# EAGLE design easyMySens-Std-V2-021 (EAGLE 7.6.0)
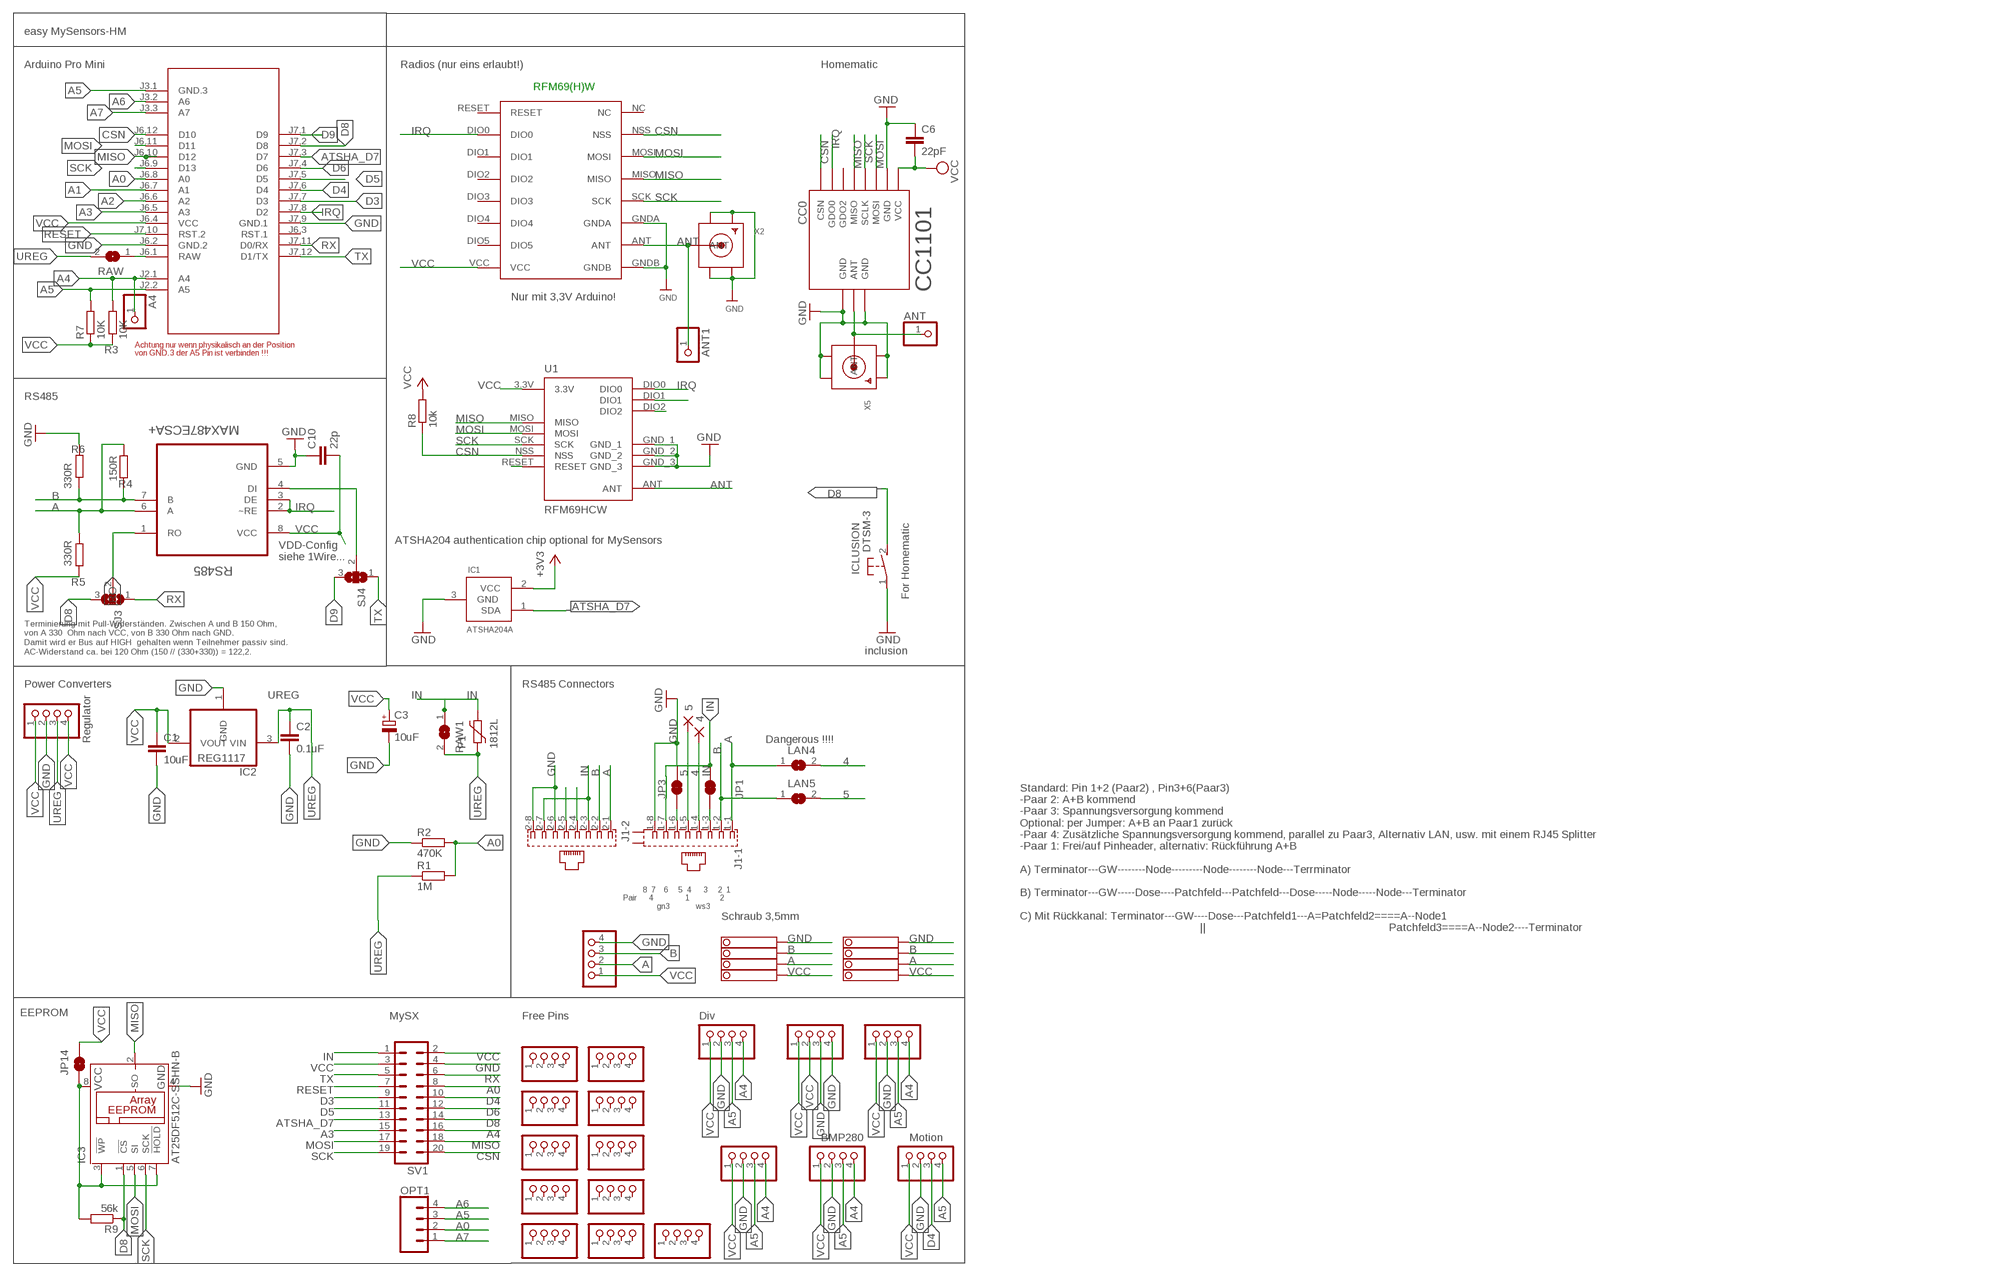
[diagram p0: schematic, sheet 1]

## Parts
4  1,6/0,8  [1,6/0,8]
5  1,6/0,8  [1,6/0,8]
A4  PINHD-1X1  [1X01]
ANT  PINHD-1X1  [1X01]
ANT1  PINHD-1X1  [1X01]
BH1750  PINHD-1X04_2.54-S  [1X04-S]
C1  10uF  C-EUC1210  [C1210]
C2  0.1uF  C-EUC1206  [C1206]
C3  10uF  CPOL-EUSMCC  [SMC_C]
C6  22pF  C-EUC0805  [C0805]
C10  22p  C-EUC0805  [C0805]
CC0  CC1101  CC1101_MODULE1SMD  [CC1101_MODULE1_SMD]
F1  1812L  [1812L]
I2C-1  PINHD-1X04_2.54-S  [1X04-S]
I2C-2  PINHD-1X04_2.54-S  [1X04-S]
I2C-3  PINHD-1X04_2.54-S  [1X04-S]
I2C-4  PINHD-1X04_2.54-S  [1X04-S]
IC1  ATSHA204A  [SOT23]
IC2  REG1117  [SOT223]
IC3  AT25DF512C-SSHN-B  25AA080SN  [SO-08]
ICLUSION  DTSM-3  [DTSM-3]
J1  557570-1  [557570-1]
JP1  JUMPER-SMT_2_NC_TRACE_SILK  [SMT-JUMPER_2_NC_TRACE_SILK]
JP2  PINHD-1X04_2.54-S  [1X04-S]
JP3  JUMPER-SMT_2_NC_TRACE_SILK  [SMT-JUMPER_2_NC_TRACE_SILK]
JP4  PINHD-1X04_2.54-S  [1X04-S]
JP5  PINHD-1X04_2.54-S  [1X04-S]
JP6  PINHD-1X04_2.54-S  [1X04-S]
JP7  PINHD-1X04_2.54-S  [1X04-S]
JP8  PINHD-1X04_2.54-S  [1X04-S]
JP9  PINHD-1X04_2.54-S  [1X04-S]
JP10  PINHD-1X04_2.54-S  [1X04-S]
JP11  PINHD-1X04_2.54-S  [1X04-S]
JP12  PINHD-1X04_2.54-S  [1X04-S]
JP13  PINHD-1X04_2.54-S  [1X04-S]
JP14  JUMPER-SMT_2_NC_TRACE_SILK  [SMT-JUMPER_2_NC_TRACE_SILK]
LAN4  SJ  [SJ]
LAN5  SJ  [SJ]
M1  ARDUINO-PRO-MINI-3.3V#NP  [ARDUINO-PRO-MINI#NP]
MOTION  PINHD-1X04_2.54-S  [1X04-S]
OPT1  CONN_04  [1X04]
R1  1M  R-EU_R0805  [R0805]
R2  470K  R-EU_R0805  [R0805]
R3  10K  R-EU_R0805  [R0805]
R4  150R  R-EU_R0805  [R0805]
R5  330R  R-EU_R0805  [R0805]
R6  330R  R-EU_R0805  [R0805]
R7  10K  R-EU_R0805  [R0805]
R8  10k  R-EU_M0805  [M0805]
R9  56k  R-EU_M0805  [M0805]
RAW  SJ  [SJ]
RAW1  SJ  [SJ]
RFM69W  RFM69HW  [RFM]
RS485  MAX487ECSA+  [SOIC127P600X175-8N]
RS485-  PINHD-1X04_2.54-S  [1X04-S]
SJ3  SJ2W  [SJ_2]
SJ4  SJ2W  [SJ_2]
STEPDWN  PINHD-1X04_2.54-S  [1X04-S]
SV1  MA10-2  [MA10-2]
U1  RFM69HCW  [RFM69HCW-XXXS2]
X1  1751264  [1751264]
X2  SMACONNECTOR_EDGE  [SMA_EDGELAUNCH]
X4  1751264  [1751264]
X5  SMACONNECTOR_EDGE  [SMA_EDGELAUNCH]

## Nets
3: J1.1-3 JP1.1
3.3V [Power]: IC1.2(VCC) ; supply symbol labelled +3V3
4: 4.1(P) J1.1-4 LAN4.2
5: 5.1(P) J1.1-5 LAN5.2
6: J1.1-6 JP3.1
A: J1.1-1 J1.2-1 LAN4.1 R4.1 R5.2 RS485-.2 RS485.6(A) X1.2 X4.2
A0: M1.J6.8(A0) OPT1.2 R1.2 R2.2 SV1.8
A1: M1.J6.7(A1)
A2: M1.J6.6(A2)
A3: M1.J6.5(A3) SV1.15
A4: A4.1 BH1750.4 I2C-1.4 I2C-2.4 I2C-4.4 M1.J2.1(A4) R3.2 SV1.16
A5: BH1750.3 I2C-1.3 I2C-2.3 I2C-4.3 M1.J2.2(A5) M1.J3.1(GND.3) MOTION.4 OPT1.3 R7.2
A6: M1.J3.2(A6) OPT1.4
A7: M1.J3.3(A7) OPT1.1
ANT: ANT1.1 RFM69W.ANT U1.ANT X2.P(ANT)
ANT0: ANT.1 CC0.ANT X5.P(ANT)
ATSHA_D7: IC1.1(SDA) M1.J7.3(D7) SV1.13
B: J1.1-2 J1.2-2 LAN5.1 R4.2 R6.1 RS485-.3 RS485.7(B) X1.3 X4.3
CSN: CC0.CSN M1.J6.12(D10) R8.1 RFM69W.NSS SV1.20 U1.NSS
D3: M1.J7.7(D3) SV1.9
D4: M1.J7.6(D4) MOTION.3 SV1.10
D5: M1.J7.5(D5) SV1.11
D6: M1.J7.4(D6) SV1.12
D8: IC3.1(!CS) ICLUSION.2 M1.J7.2(D8) R9.1 SJ3.3 SV1.14
D9: M1.J7.1(D9) SJ4.3
DI1: RS485.4(DI) SJ4.2
GND [Power]: BH1750.2 C1.2 C2.2 C3.- C6.1 C10.1 CC0.GND@0(GND) CC0.GND@1(GND) CC0.GND@2(GND) I2C-1.2 I2C-2.2 I2C-3.3 I2C-3.4 I2C-4.2 IC1.3(GND) IC2.1(GND) IC3.4(GND) ICLUSION.1 J1.1-8 J1.2-6 J1.2-8 JP3.2 M1.J6.2(GND.2) M1.J7.9(GND.1) MOTION.2 R2.1 R6.2 RFM69W.GNDA RFM69W.GNDB RS485-.4 RS485.5(GND) STEPDWN.2 SV1.4 U1.GND_1 U1.GND_2 U1.GND_3 X1.4 X2.GND@1(GND4) X2.GND@2(GND3) X2.GND@3(GND2) X2.GND@4(GND1) X4.4 X5.GND@1(GND4) X5.GND@2(GND3) X5.GND@3(GND2) X5.GND@4(GND1)
IN [Power]: F1.P$2 J1.1-7 J1.2-3 J1.2-7 JP1.2 RAW1.1 SV1.1
IRQ: CC0.GDO0 M1.J7.8(D2) RFM69W.DIO0 RS485.2(~RE) RS485.3(DE) U1.DIO0
MISO: CC0.MISO IC3.2(SO) M1.J6.10(D12) RFM69W.MISO SV1.18 U1.MISO
MOSI: CC0.MOSI IC3.5(SI) M1.J6.11(D11) RFM69W.MOSI SV1.17 U1.MOSI
N$1: U1.RESET
N$2: J1.2-4
N$5: J1.2-5
N$14: U1.DIO2
N$15: U1.DIO1
RAW [Power]: M1.J6.1(RAW) RAW.1
RESET: M1.J7.10(RST.2) SV1.7
RO: RS485.1(RO) SJ3.2
RX: M1.J7.11(D0/RX) SJ3.1 SV1.6
SCK: CC0.SCLK IC3.6(SCK) M1.J6.9(D13) RFM69W.SCK SV1.19 U1.SCK
TX: M1.J7.12(D1/TX) SJ4.1 SV1.5
UREG [Power]: C2.1 F1.P$1 IC2.3(VIN) R1.1 RAW1.2 RAW.2 STEPDWN.3
VCC [Power]: BH1750.1 C1.1 C3.+ C6.2 C10.2 CC0.VCC I2C-1.1 I2C-2.1 I2C-3.1 I2C-3.2 I2C-4.1 IC2.2(VOUT) JP14.2 M1.J6.4(VCC) MOTION.1 R3.1 R5.1 R7.1 R8.2 RFM69W.VCC RS485-.1 RS485.8(VCC) STEPDWN.1 STEPDWN.4 SV1.2 SV1.3 U1.3.3V X1.1 X4.1
VCC1 [Power]: IC3.3(!WP) IC3.7(!HOLD) IC3.8(VCC) JP14.1 R9.2
Unconnected: CC0.GDO2 J1.G1(-1:S2) J1.G3(-1:S1) JP2.1 JP2.2 JP2.3 JP2.4 JP4.1 JP4.2 JP4.3 JP4.4 JP5.1 JP5.2 JP5.3 JP5.4 JP6.1 JP6.2 JP6.3 JP6.4 JP7.1 JP7.2 JP7.3 JP7.4 JP8.1 JP8.2 JP8.3 JP8.4 JP9.1 JP9.2 JP9.3 JP9.4 JP10.1 JP10.2 JP10.3 JP10.4 JP11.1 JP11.2 JP11.3 JP11.4 JP12.1 JP12.2 JP12.3 JP12.4 JP13.1 JP13.2 JP13.3 JP13.4 M1.J6.3(RST.1) RFM69W.DIO1 RFM69W.DIO2 RFM69W.DIO3 RFM69W.DIO4 RFM69W.DIO5 RFM69W.NC RFM69W.RESET

## Notes on the sheet
- easy MySensors-HM
- Arduino Pro Mini | Radios (nur eins erlaubt!) | Homematic
- RFM69(H)W
- CC1101
- Nur mit 3,3V Arduino!
- Achtung nur wenn physikalisch an der Position 
  von GND.3 der A5 Pin ist verbinden !!!
- RS485
- ATSHA204 authentication chip optional for MySensors
- VDD-Config
  siehe 1Wire...
- For Homematic
- Terminierung mit Pull-Widerständen. Zwischen A und B 150 Ohm,
  von A 330  Ohm nach VCC, von B 330 Ohm nach GND. 
  Damit wird er Bus auf HIGH  gehalten wenn Teilnehmer passiv sind.
  AC-Widerstand ca. bei 120 Ohm (150 // (330+330)) = 122,2.
- inclusion
- Power Converters | RS485 Connectors
- Regulator | Dangerous !!!!
- 8  7    6     5  4      3     2  1
  Pair      4                1               2
                   gn3             ws3
- Schraub 3,5mm
- Standard: Pin 1+2 (Paar2) , Pin3+6(Paar3) 
  -Paar 2: A+B kommend 
  -Paar 3: Spannungsversorgung kommend
  Optional: per Jumper: A+B an Paar1 zurück
  -Paar 4: Zusätzliche Spannungsversorgung kommend, parallel zu Paar3, Alternativ LAN, usw. mit einem RJ45 Splitter 
  -Paar 1: Frei/auf Pinheader, alternativ: Rückführung A+B
  
  A) Terminator---GW--------Node---------Node--------Node---Terrminator
  
  B) Terminator---GW-----Dose----Patchfeld---Patchfeld---Dose-----Node-----Node---Terminator 
  
  C) Mit Rückkanal: Terminator---GW----Dose---Patchfeld1---A=Patchfeld2====A--Node1
                                                              ||                                                             Patchfeld3====A--Node2----Terminator
- EEPROM
- MySX | Free Pins | Div
- BMP280 | Motion

## Library data of the parts
4 5 = wirepad:1,6/0,8: THROUGH-HOLE PAD
A4 ANT ANT1 = pinhead:PINHD-1X1: PIN HEADER
BH1750 I2C-1-I2C-4 JP2 JP4-JP13 MOTION RS485- STEPDWN = pinhead-2:PINHD-1X04: PIN HEADER
C1 C2 C6 C10 = rcl:C-EU: CAPACITOR, European symbol
C3 = rcl:CPOL-EU: POLARIZED CAPACITOR, European symbol
CC0 = wireless:CC1101_MODULE1: CC1101 wireless module for 433/868 MHz (sold from Aliexpress). DIL version for mounting with pin header (and SMD soldering) and SMD only variant available.
F1 = ptc-littlefuse:1812L
IC1 = Sensor:ATSHA204A
IC2 = burr-brown:REG1117: 800mA and 1A Low Dropout (LDO) Positive Regulator 1.8V, 2.5V, 2.85V, 3.3V, 5V, and Adj; MPN: REG1117; OC_FARNELL: 1097566; OC_NEWARK: 14P6981
IC3 = microchip:25*: Serial EEPROM 4K/ 8K , SPI bus; MF: MICROCHIP; MPN: 25AA080/SN; OC_FARNELL: 1816072; OC_NEWARK: 92C7351
ICLUSION = mechanics:DTSM-3: Diptronics SMD button 6x3.5 mm
J1 = con-amp:557570-1: AMP connector
JP1 JP3 JP14 = SparkFun-Jumpers:JUMPER-SMT_2_NC_TRACE: Normally closed trace jumper This jumper has a trace between two pads so it's normally closed (NC). Use a razor knife to open the connection. For best results follow the IPC guidelines for cutting traces: Cutout at least 0.063 mm (0.005 in). Remove all loose material to clean up the cut area. Seal the cut with an approved epoxy. Reapply solder to reclose the connection.
LAN4 LAN5 RAW RAW1 = jumper:SJ: SMD solder JUMPER
M1 = diy-modules:ARDUINO-PRO-MINI-*#NP: Arduino Pro Mini without programming pads
OPT1 = SparkFun-Connectors:CONN_04: Multi connection point. Often used as Generic Header-pin footprint for 0.1 inch spaced/style header connections On any of the 0.1 inch spaced packages, you can populate with these: Break Away Headers - Straight <https://www.sparkfun.com/products/116> (PRT-00116) Break Away Male Headers - Right Angle <https://www.sparkfun.com/products/553> (PRT-00553) Female Headers <https://www.sparkfun.com/products/115> (PRT-00115) Break Away Headers - Machine Pin <https://www.sparkfun.com/products/117> (PRT-00117) Break Away Female Headers - Swiss Machine Pin <https://www.sparkfun.com/products/743> (PRT-00743) For SCREWTERMINALS and SPRING TERMINALS visit here: Screw Terimnals on SparkFun.com <https://www.sparkfun.com/search/results?term=Screw+Terminals> (5mm/3.5mm/2.54mm spacing) This device is also useful as a general connection point to wire up your design to another part of your project. Our various solder wires solder well into these plated through hole pads. Hook-Up Wire - Assortment (Stranded, 22 AWG) <https://www.sparkfun.com/products/11375> (PRT-11375) Hook-Up Wire - Assortment (Solid Core, 22 AWG) <https://www.sparkfun.com/products/11367> (PRT-11367) View the entire wire category on our website here <https://www.sparkfun.com/categories/141> Special notes: Molex polarized connector foot print use with SKU : PRT-08231 with associated crimp pins and housings. 1MM SMD Version SKU: PRT-10208; PROD_ID: CONN-09696
R1-R8 = rcl:R-EU_: RESISTOR, European symbol
R9 = resistor:R-EU_: RESISTOR, European symbol
RFM69W = hoperf:RFM69HW
RS485 = Maxim_By_element14_Batch_1:MAX487ECSA+: Low-Power, Slew-Rate-Limited RS-485/RS-422 Transceivers; MPN: MAX487ECSA+; OC_FARNELL: 9724532; OC_NEWARK: 68K4803; PACKAGE: SOIC-8; SUPPLIER: Maxim
SJ3 SJ4 = jumper:SJ2W: SMD solder JUMPER
SV1 = con-lstb:MA10-2: PIN HEADER; OC_FARNELL: unknown; OC_NEWARK: unknown
U1 = doug:RFM69H
X1 X4 = con-phoenix-350:1751264: MKDS 1/ 4-3,5 Printklemme Nennstrom: 10 A Bemessungsspannung: 160 V Raster: 3,5 mm Polzahl: 4 Montageart: Löten Anschlussart: Schraubanschluss Anschlussrichtung vom Leiter zur Platine: 0° Source: http://eshop.phoenixcontact.com .. 1751264.pdf; MPN: 1751264; OC_FARNELL: unknown; OC_NEWARK: 10R0934
X2 X5 = adafruit:SMACONNECTOR: SMA Connector 90° DIP SMA Connector, 50 Ohm (4UConnector: 07259)

## Net classes
0 default: width 0.305 mm
1 Power: width 0.508 mm

## Board
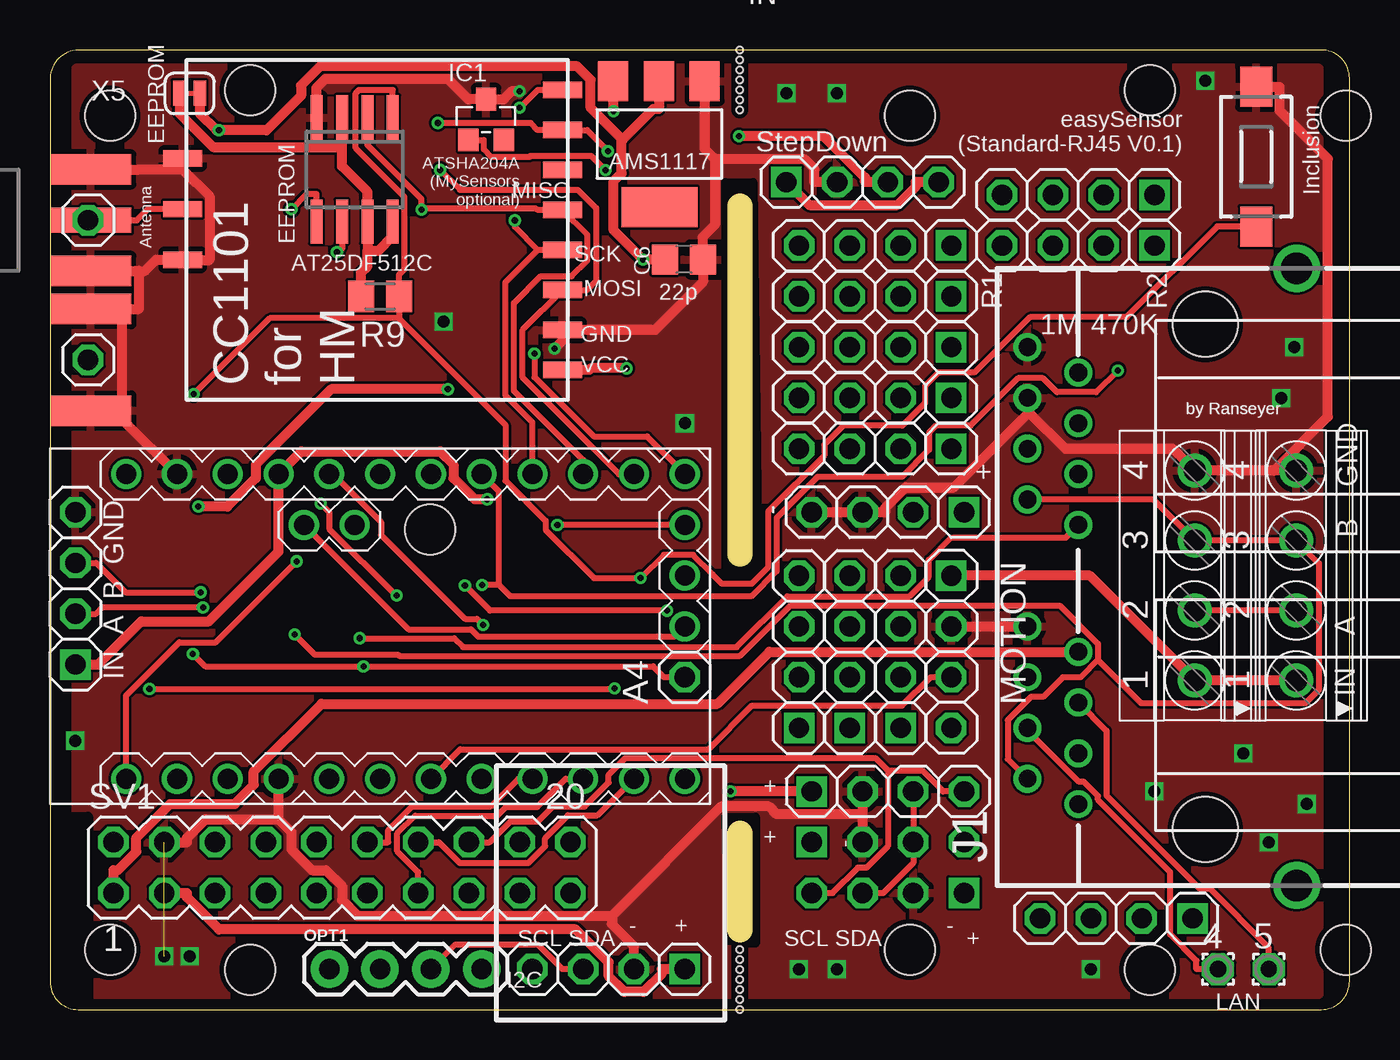
[diagram p1: board, top side]
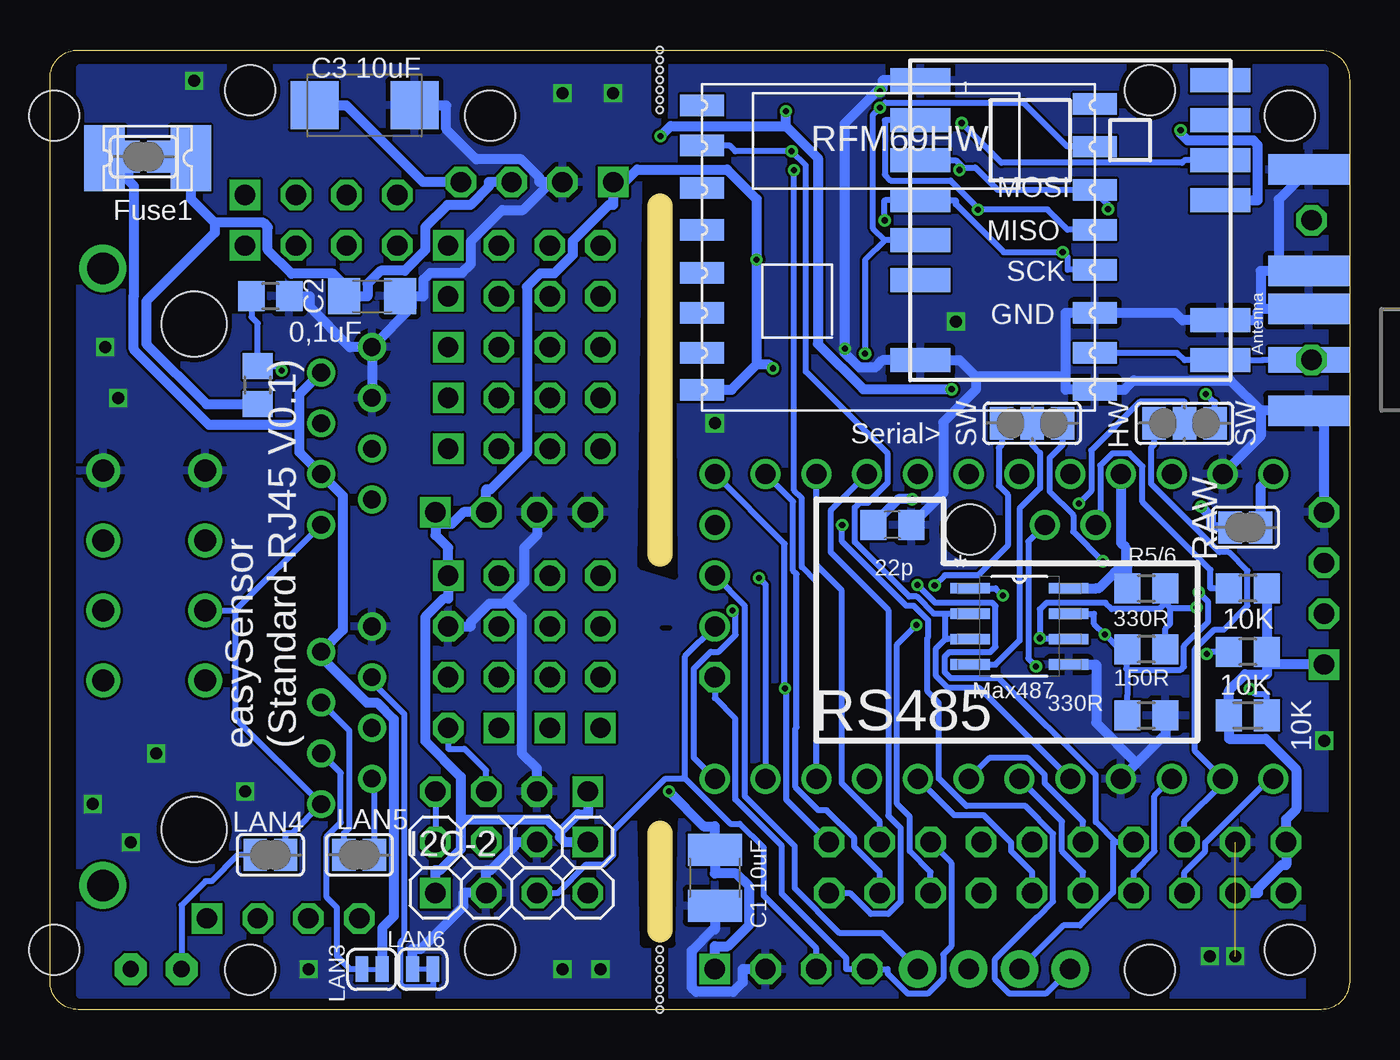
[diagram p2: board, bottom side, seen from below]

Size 65 x 48 mm. Coordinates in mm from the lower left corner, seen from the top.
Outline: 0,1.39 arc90 1.41,0 63.59,0 arc90 65,1.41 65,46.59 arc90 63.59,48 1.41,48 arc90 0,46.47 0,1.39
Copper layers (1*16): Top 0.035mm / dielectric 1.5mm / Bottom 0.035mm
Design rules "dirt_cheap_dirty_boards.v1": minimum track width 5mil, minimum drill 12mil, track to track 5mil, track to pad 5mil, pad to pad 5mil, via to via 5mil, smd to smd 0mil, copper to edge 10mil, drill to drill 10mil, minimum pad ring 10mil, minimum via ring 6mil, stop-mask expansion 2mil, vias tented up to drill 25mil, thermal gap 10mil
Holes 2.5 mm at 19,24 3,3 3,44.7 64.8,44.7 43,3 64.8,3 43,44.7 10,2 55,2 10,46 55,46
Holes 0.3 mm at 34.5,3 34.5,2.5 34.5,2 34.5,1.5 34.5,1 34.5,0.5 34.5,45 34.5,45.5 34.5,46 34.5,46.5 34.5,47 34.5,47.5 34.5,48 34.5,0
tRestrict: area 33.8,21.7 to 35.4,41.4; area 33.8,3.3 to 35.3,9.6; area 0.6,0.8 to 1.9,9.6; 2 lines
bRestrict: area 33.8,21.7 to 35.4,41.3; area 33.8,3.3 to 35.4,9.5; area 0.6,0.8 to 1.9,9.6; 2 lines
Milling: 2 lines

### Footprints (pad centres in the part's own frame; a part is rotated, then mirrored left to right if it is on the bottom)
1,6/0,8 = drill 0.813 pad 1.6 octagon: 1 0,0
1X01 = drill 1.016 octagon: 1 0,0
1X04-S = drill 1.016 square: 1 -3.81,0 | drill 1.016 octagon: 2 -1.27,0; 3 1.27,0; 4 3.81,0
C1210 = smd 1.6 x 2.7: 1 -1.4,0; 2 1.4,0
C1206 = smd 1.6 x 1.8: 1 -1.4,0; 2 1.4,0
SMC_C = smd 2.4 x 2.4: + -2.5,0; - 2.5,0
C0805 = smd 1.3 x 1.5: 1 -0.95,0; 2 0.95,0
CC1101_MODULE1_SMD = smd 1.93 x 0.813: ANT 19,5.96; CSN 0,0; GDO0 0,2; GDO2 0,4; GND@0 0,12; GND@1 19,8.5; GND@2 19,3.42; MISO 0,6; MOSI 0,10; SCLK 0,8; VCC 0,14
1812L = smd 2.03 x 3.3: P$1 -2.16,0; P$2 2.16,0
SOT23 = smd 1.016 x 1.143: 1 -0.889,-1.016; 2 0.889,-1.016; 3 0,1.016
SOT223 = smd 1.499 x 2.007: 1 -2.261,-3.15; 2 0.025,-3.15; 3 2.311,-3.15 | smd 3.81 x 2.007: 4 0,3.15
SO-08 = smd 0.6 x 2.2: 1 -1.905,-2.6; 2 -0.635,-2.6; 3 0.635,-2.6; 4 1.905,-2.6; 5 1.905,2.6; 6 0.635,2.6; 7 -0.635,2.6; 8 -1.905,2.6
DTSM-3 = smd 2 x 1.6: 1 -3.494,0; 2 3.494,0
557570-1 = drill 0.889: 1-1 -11.43,6.35; 1-2 -10.16,8.89; 1-3 -8.89,6.35; 1-4 -7.62,8.89; 1-5 -6.35,6.35; 1-6 -5.08,8.89; 1-7 -3.81,6.35; 1-8 -2.54,8.89; 2-1 2.54,6.35; 2-2 3.81,8.89; 2-3 5.08,6.35; 2-4 6.35,8.89; 2-5 7.62,6.35; 2-6 8.89,8.89; 2-7 10.16,6.35; 2-8 11.43,8.89 | drill 1.575 pad 2.184: G1 -15.494,-4.572; G3 15.367,-4.572 | hole 3.251: -12.7,0; 12.573,0
SMT-JUMPER_2_NC_TRACE_SILK = smd 0.635 x 1.27: 1 -0.508,0; 2 0.508,0
SJ = smd 1.168 x 1.6: 1 -0.762,0; 2 0.762,0
ARDUINO-PRO-MINI#NP = drill 1: J2.1 -1.27,5.08; J2.2 -3.81,5.08; J3.1 15.24,0; J3.2 15.24,2.54; J3.3 15.24,5.08; J6.1 -12.7,7.62; J6.2 -10.16,7.62; J6.3 -7.62,7.62; J6.4 -5.08,7.62; J6.5 -2.54,7.62; J6.6 0,7.62; J6.7 2.54,7.62; J6.8 5.08,7.62; J6.9 7.62,7.62; J6.10 10.16,7.62; J6.11 12.7,7.62; J6.12 15.24,7.62; J7.1 15.24,-7.62; J7.2 12.7,-7.62; J7.3 10.16,-7.62; J7.4 7.62,-7.62; J7.5 5.08,-7.62; J7.6 2.54,-7.62; J7.7 0,-7.62; J7.8 -2.54,-7.62; J7.9 -5.08,-7.62; J7.10 -7.62,-7.62; J7.11 -10.16,-7.62; J7.12 -12.7,-7.62
1X04 = drill 1.016 pad 1.88: 1 0,0; 2 2.54,0; 3 5.08,0; 4 7.62,0
R0805 = smd 1.3 x 1.5: 1 -0.95,0; 2 0.95,0
M0805 = smd 1.3 x 1.6: 1 -0.95,0; 2 0.95,0
RFM = smd 2.184 x 1.067: ANT 19.651,2.889; DIO0 0,13.27; DIO1 0,11.143; DIO2 0,9.047; DIO3 0,6.889; DIO4 0,4.889; DIO5 0,2.889; GNDA 19.651,4.889; GNDB 19.651,1.048; MISO 19.651,9.047; MOSI 19.651,11.047; NC 19.651,15.334; NSS 19.651,13.206; RESET 0,15.27; SCK 19.651,7.048; VCC 0,1.048
SOIC127P600X175-8N = smd 1.981 x 0.533: 1 -2.464,1.905; 2 -2.464,0.635; 3 -2.464,-0.635; 4 -2.464,-1.905; 5 2.464,-1.905; 6 2.464,-0.635; 7 2.464,0.635; 8 2.464,1.905
SJ_2 = smd 1.168 x 1.6: 1 -1.524,0; 2 0,0; 3 1.524,0
MA10-2 = drill 1.016 octagon: 1 -11.43,-1.27; 2 -11.43,1.27; 3 -8.89,-1.27; 4 -8.89,1.27; 5 -6.35,-1.27; 6 -6.35,1.27; 7 -3.81,-1.27; 8 -3.81,1.27; 9 -1.27,-1.27; 10 -1.27,1.27; 11 1.27,-1.27; 12 1.27,1.27; 13 3.81,-1.27; 14 3.81,1.27; 15 6.35,-1.27; 16 6.35,1.27; 17 8.89,-1.27; 18 8.89,1.27; 19 11.43,-1.27; 20 11.43,1.27
RFM69HCW-XXXS2 = smd 3 x 1.2: 3.3V 7.5,1; ANT 7.5,-7; DIO0 7.5,3; DIO1 7.5,5; DIO2 7.5,7; GND_1 7.5,-5; GND_2 -7.5,-7; GND_3 -7.5,7; MISO -7.5,5; MOSI -7.5,3; NSS -7.5,-1; RESET -7.5,-3; SCK -7.5,1
1751264 = drill 1.1 pad 1.7: 1 -5.25,-0.1; 2 -1.75,-0.1; 3 1.75,-0.1; 4 5.25,-0.1
SMA_EDGELAUNCH = smd 4.064 x 1.524: GND@1 2.032,-2.54; GND@2 2.032,2.54 | smd 4.064 x 1.524 bottom: GND@3 2.032,2.54; GND@4 2.032,-2.54 | smd 4.064 x 1.27: P 2.032,0

### Placement (x,y rotation side)
4  58.42,2.02 0 top
5  60.96,2.02 0 top
A4  31.75,16.62 90 top
ANT  1.91,39.48 0 top
ANT1  1.91,32.5 0 top
BH1750  41.91,8.37 180 bottom
C1  31.75,6.59 270 bottom
C2  48.9,35.68 0 bottom
C3  49.27,45.23 0 bottom
C6  31.71,37.52 180 top
C10  22.86,24.24 180 bottom
CC0  25.64,46 180 top
F1  60.12,42.59 180 bottom
I2C-1  41.91,10.91 0 top
I2C-2  41.91,5.83 0 bottom
I2C-3  41.91,24.88 180 top
I2C-4  27.94,2.02 180 top
IC1  21.81,44.52 0 top
IC2  30.48,43.3 180 top
IC3  15.24,42.02 180 top
ICLUSION  60.33,42.66 270 top
J1  57.78,21.7 90 top
JP1  48.9,2.02 0 bottom
JP2  40.01,17.89 90 top
JP3  46.35,2.02 180 bottom
JP4  42.55,17.89 90 top
JP5  41.27,28.05 180 top
JP6  41.27,30.59 180 top
JP7  53.34,4.56 180 top
JP8  51.44,38.22 180 top
JP9  37.47,17.89 90 top
JP10  41.27,33.14 180 top
JP11  41.27,35.68 180 top
JP12  41.27,38.22 180 top
JP13  51.44,40.76 180 top
JP14  6.99,45.84 0 top
LAN4  53.98,7.74 180 bottom
LAN5  49.53,7.74 180 bottom
M1  16.51,19.16 0 top
MOTION  45.09,17.89 270 top
OPT1  13.97,2.02 0 top
R1  54.61,31.23 90 bottom
R2  53.98,35.68 180 bottom
R3  5.08,17.89 180 bottom
R4  10.16,18.02 180 bottom
R5  10.16,21.07 0 bottom
R6  10.16,14.72 0 bottom
R7  5.08,21.07 180 bottom
R8  5.08,14.72 180 bottom
R9  16.51,35.68 180 top
RAW  5.21,24.12 180 bottom
RAW1  60.33,42.66 0 bottom
RFM69W  32.38,29.96 0 bottom
RS485  16.51,19.16 0 bottom
RS485-  1.27,21.07 90 top
SJ3  8.26,29.32 0 bottom
SJ4  15.88,29.32 180 bottom
STEPDWN  40.64,41.39 0 top
SV1  14.61,7.1 0 top
U1  13.97,39.48 0 bottom
X1  57.15,21.7 90 top
X2  0,32.5 180 bottom
X4  62.23,21.7 90 top
X5  0,39.48 0 top

### Tracks (layer width: path | path; a pad name or v marks a point on that pad's centre or on a via)
3
  Bottom 0.305: JP1.1 50,2.02 50.65,2.67 50.65,5.09 51.16,5.6 51.16,8.66 50.45,9.36 50.45,11.83 J1.1-3
4
  Top 0.305: 4.1 57.34,2.02 57.34,2.45 56.03,3.76 56.03,6.87 52.41,10.49 52.41,10.68 51.7,11.39 51.47,11.39 48.9,13.97 J1.1-4
  Bottom 0.305: LAN4.2 55.6,7.74 56.92,6.41 57.22,6.41 58.42,5.21 4.1
5
  Top 0.305: 5.1 60.96,3.1 58,6.06 57.49,6.06 52.84,10.71 52.84,13.95 J1.1-5
  Bottom 0.305: LAN5.2 50.29,8.81 50.02,9.09 50.02,13.94 J1.1-5
6
  Bottom 0.305: J1.1-6 48.9,16.39 47.27,14.77 47.27,3.57 47.46,3.38 47.46,1.26 47.3,1.11 45.85,1.11 JP3.1
A  (via drill 0.3 pad 0.61)
  Top 0.305: RS485-.2 2.31,19.8 2.62,20.11 v7.65,20.11 | v15.49,18.57 20.22,18.57 20.66,18.13 34.35,18.13 36.88,20.66 42.98,20.66 43.96,21.64 43.96,22.5 45.07,23.61 50.8,23.61 J1.2-1 | X4.2 X1.2
  Bottom 0.305: 8.97,20.08 9.22,20.33 | 8.97,20.08 8.97,19.29 9.21,19.05 R4.1 | 8.97,20.08 7.68,20.08 v7.65,20.11 | 9.22,20.33 9.51,20.04 11.89,20.04 12.2,20.35 15.15,20.35 15.49,20.01 v15.49,18.57 15.36,18.57 15.32,18.53 RS485.6 | LAN4.1 53.21,8.81 52.9,8.81 J1.1-1 55.73,14.56 55.73,19.95 | R5.2 9.21,20.33 9.22,20.33 | 55.73,19.95 J1.2-1 | X1.2 55.73,19.95
A0  (via drill 0.3 pad 0.61)
  Top 0.305: 22.46,21.24 v21.61,21.24 | v53.41,31.97 52.33,30.89 50.36,30.89 49.67,31.58 48.42,31.58 46.05,29.21 44.32,29.21 43.97,28.86 43.97,28 42.61,26.65 38.39,26.65 36.35,24.6 36.35,21.94 35.08,20.67 23.03,20.67 22.46,21.24 | 22.46,21.24 22.46,25.91 M1.J6.8
  Bottom 0.305: 11.68,8.37 12.7,9.39 12.7,11.74 17.53,16.57 19.94,16.57 20.24,16.87 20.24,17.65 20.01,17.88 17.96,17.88 17.7,18.15 17.7,20.18 17.87,20.35 20.71,20.35 v21.61,21.24 | 11.68,8.37 11.84,8.37 11.84,5.85 13.48,4.21 14.32,4.21 OPT1.2 | SV1.8 11.68,8.37 | v53.41,31.97 53.58,32.14 53.58,32.18 R1.2 54.61,34.33 54.92,34.65 R2.2
A3  (via drill 0.3 pad 0.61)
  Top 0.305: M1.J6.5 14.17,26.79 16.55,24.4 16.55,23.74 20.75,19.54 21.36,19.54 v21.66,19.24
  Bottom 0.305: v21.66,19.24 22.63,18.27 22.63,10.28 22,9.65 22,7.91 20.95,6.87 SV1.15
A4  (via drill 0.3 pad 0.61)
  Top 0.305: v7.15,17.79 7.77,17.17 v15.68,17.17 30.17,17.17 30.71,16.62 A4.1 | 41.91,11.96 41.91,8.16 40.85,7.1 40.41,7.1 39.14,5.83 I2C-2.4 | 41.91,11.96 41.28,12.58 28.78,12.58 27.94,11.74 27.94,11.35 26.74,10.15 25.16,10.15 24.42,9.42 23.04,9.42 22,8.37 SV1.16 | 41.91,11.96 43.63,11.96 44.68,10.91 I2C-1.4
  Bottom 0.305: M1.J2.1 16.07,23.41 16.07,17.56 v15.68,17.17 | A4.1 31.75,15.58 30.71,14.55 30.71,10.5 28.4,8.18 28.4,5.8 25.17,2.57 25.17,2.02 I2C-4.4 23.09,2.02 23.09,1.79 22.09,0.8 21.09,0.8 20.32,1.56 20.32,2.76 19.91,3.16 19.91,7.33 SV1.16 | v7.15,17.79 7.07,17.79 6.96,17.89 R3.2 | I2C-1.4 BH1750.4
A5
  Top 0.305: M1.J2.2 17.93,19.02 21.05,19.02 21.42,18.65 31.24,18.65 M1.J3.1 | I2C-2.3 41.68,5.83 43.18,7.33 BH1750.3 I2C-1.3 | I2C-4.3 25.63,2.02 24.41,3.24 20.27,3.24 OPT1.3
  Bottom 0.305: 33.23,11.56 33.23,17.69 M1.J3.1 | R7.2 6.96,21.07 6.96,22 10.36,25.4 10.36,27.17 11.01,27.82 11.86,27.82 12.46,27.21 12.46,24.48 M1.J2.2 | 33.23,11.56 34.21,11.56 36.82,8.95 36.82,7.73 37.29,7.25 38.18,7.25 39.6,5.83 I2C-2.3 | 33.23,11.56 30.96,9.3 30.5,9.3 29.31,8.1 29.31,5.7 26.67,3.06 I2C-4.3 | MOTION.4 45.09,13.04 44.27,13.04 43.18,11.95 I2C-1.3
A6
  Bottom 0.305: OPT1.4 23.39,3.82 25.5,3.82 27.75,6.07 27.75,8.17 30.24,10.66 30.24,20.2 M1.J3.2
A7  (via drill 0.3 pad 0.61)
  Top 0.305: M1.J3.3 v25.38,24.24
  Bottom 0.305: OPT1.1 15.19,0.8 17.02,0.8 17.73,1.51 17.73,2.52 15.62,4.64 15.6,4.64 14.83,5.4 14.83,8.8 16.21,10.18 19.16,10.18 20.54,11.56 20.54,15.34 21.11,15.91 21.11,18.61 21.07,18.64 21.07,19.47 21.79,20.19 22.17,20.19 25.38,23.4 v25.38,24.24
ANT
  Bottom 0.305: RFM69W.ANT 8.61,32.85 8.25,32.48 U1.ANT 4.36,32.48 4.34,32.5 X2.P ANT1.1
ANT0
  Top 0.305: CC0.ANT 4.9,40.04 4.34,39.48 X5.P ANT.1
ATSHA_D7  (via drill 0.3 pad 0.61)
  Top 0.305: IC1.1 21.71,43.5 21.71,43.02 22.07,42.65 23.99,42.65 24.03,42.69 27.08,42.69 v27.78,41.99 | SV1.13 18.41,6.87 17.37,7.91 17.37,8.8 18.27,9.7 22.37,9.7 22.8,10.13 24.37,10.13 25.79,11.54 M1.J7.3
  Bottom 0.305: M1.J7.3 26.67,21.4 27.4,22.13 27.4,25.58 27.78,25.97 v27.78,41.99
B  (via drill 0.3 pad 0.61)
  Top 0.305: v12.24,18.76 13.25,17.75 17.4,17.75 17.46,17.69 34.52,17.69 37.04,20.21 50.5,20.21 52.41,18.3 52.41,17.49 | v7.54,20.87 3.78,20.87 2.31,22.34 RS485-.3 | 52.41,17.49 54.58,15.32 62.8,15.32 63.46,15.99 63.46,22.32 X4.3 X1.3 55.19,25.51 J1.2-2 | 52.41,17.49 51.55,16.62 50.66,16.62 49.68,15.64 49.07,15.64 47.91,14.49 47.91,12.53 J1.1-2
  Bottom 0.305: 11.11,16.99 8.45,16.99 8.28,17.15 8.28,18.18 7.07,19.39 7.07,20.39 v7.54,20.87 | 11.11,16.99 11.11,15.75 R6.1 | 11.17,18.02 11.17,17.05 11.11,16.99 | RS485.7 12.78,19.8 12.78,19.29 v12.24,18.76 11.5,18.02 11.17,18.02 | R4.2 11.17,18.02 | LAN5.1 48.77,11.42 J1.1-2
CSN  (via drill 0.3 pad 0.61)
  Top 0.305: v4.97,16.04 28.22,16.04 v28.25,16.06 | v24.23,32.81 24.23,31.64 27.2,28.66 29.87,28.66 M1.J6.12 | CC0.CSN 24.39,46 23.51,45.12 v23.48,45.12
  Bottom 0.305: M1.J6.12 28.26,23.3 28.26,16.08 v28.25,16.06 28.18,15.99 28.18,10.51 SV1.20 | 23.25,38.48 23.84,39.07 23.84,44.77 v23.48,45.12 23.46,45.12 23.22,45.37 16.3,45.37 14.11,43.17 RFM69W.NSS | 23.25,38.48 24.23,37.51 v24.23,32.81 | R8.1 4.13,15.8 4.74,15.8 v4.97,16.04 | U1.NSS 23.25,38.48
D3
  Bottom 0.305: SV1.9 13.34,6.87 14.38,7.91 14.38,9.41 M1.J7.7
D4
  Top 0.305: MOTION.3 44.04,16.62 42.62,15.2 35.12,15.2 32.93,13.02 20.52,13.02 M1.J7.6
  Bottom 0.305: SV1.10 13.34,9.41 15.24,11.32 15.24,11.74 16.09,12.58 18.01,12.58 M1.J7.6
D5
  Bottom 0.305: SV1.11 15.88,6.87 16.92,7.91 16.92,8.34 18.29,9.72 19.77,9.72 M1.J7.5
D6
  Top 0.305: SV1.12 16.92,8.37 16.92,8.96 18.12,10.17 22.05,10.17 23.43,11.54 M1.J7.4
D8  (via drill 0.3 pad 0.61)
  Top 0.305: 17.44,34.58 22.78,29.24 22.78,26.46 24.79,24.44 24.79,24 27.2,21.58 v29.54,21.58 30.7,22.74 32.17,22.74 33.14,21.78 33.14,21.77 33.61,21.29 35.09,21.29 35.91,22.12 35.91,24.9 38.73,27.72 38.73,28.26 39.69,29.21 42.63,29.21 43.77,30.34 43.77,31.19 44.44,31.86 46.23,31.86 49,34.63 53.85,34.63 58.38,39.17 ICLUSION.2 | 17.44,34.58 10.99,34.58 v7.19,30.78 | 17.44,34.58 17.46,34.6 17.46,34.7 R9.1 17.46,36.75 17.73,37.03 17.73,40.64 15.3,43.08 15.3,45.84 15.46,46 17.14,46 IC3.1 | M1.J7.2 27.39,9.72 25.91,9.72 24.77,8.57 24.77,8.16 23.93,7.33 20.5,7.33 19.46,8.37 SV1.14
  Bottom 0.305: v29.54,21.58 29.21,21.25 M1.J7.2 | SJ3.3 6.73,30.4 6.82,30.4 v7.19,30.78
D9  (via drill 0.3 pad 0.61)
  Top 0.305: v30.86,19.95 22.01,19.95 v20.75,21.21
  Bottom 0.305: v20.75,21.21 20.25,21.72 18.58,21.72 17.09,23.21 17.09,25.75 17.55,26.21 17.55,28.09 17.4,28.24 SJ4.3 | M1.J7.1 32.8,12.59 32.8,17.06 31.96,17.9 31.55,17.9 30.71,18.74 30.71,19.81 v30.86,19.95
DI1
  Bottom 0.305: RS485.4 17.7,17.26 16.51,18.46 16.51,25.06 15.48,26.09 15.48,27.85 15.88,28.24 SJ4.2
GND  (via drill 0.3 pad 0.61, 0.6)  (1 unrouted)
  Top 0.508: 11.43,9.51 12.06,8.88 12.06,8.02 13.11,6.97 13.81,6.97 14.61,6.18 14.61,5.48 15.4,4.69 28.1,4.69 | 11.43,9.51 7.78,9.51 6.86,8.59 6.86,8.37 SV1.4 | 11.43,9.51 M1.J7.9 | I2C-4.2 29.21,3.16 28.1,4.27 28.1,4.69 | 40.64,9.77 36.34,9.77 35.95,10.15 33.57,10.15 28.1,4.69 | 40.64,9.77 BH1750.2 | I2C-1.2 40.64,9.77 | 48.97,29.87 45.21,26.11 42.8,26.11 41.78,25.1 41.78,24.88 I2C-3.3 I2C-3.4 | v25.24,33.06 25.64,33.46 CC0.GND@0 30.27,34 32.66,36.39 C6.1 32.66,38.65 33.26,39.25 33.26,42.53 | v23.48,45.93 23.1,45.93 22.7,45.53 IC1.3 20.92,45.53 19.91,46.54 13.77,46.54 13.34,46.11 IC3.4 | 6.63,42.02 7.98,40.68 7.98,37.5 CC0.GND@1 5.29,37.5 4.73,36.95 4.45,36.95 | 33.26,42.53 32.74,43.05 32.74,45.06 IC2.1 | M1.J6.2 3.74,29.4 3.74,29.96 | X2.GND@3 3.74,29.96 | 3.59,35.04 3.59,30.11 3.74,29.96 | 3.59,35.04 4.45,35.04 4.45,36.95 | X2.GND@1 3.59,35.04 | 33.26,42.53 37.75,42.53 38.23,42.06 38.23,41.39 STEPDWN.2 | 48.97,29.87 50.79,28.05 56.15,28.05 X1.4 61.23,26.95 | J1.2-6 48.97,30.52 48.97,29.87 | ICLUSION.1 61.51,46.15 61.51,44.97 63.92,42.56 63.92,29.65 61.23,26.95 | X4.4 61.23,26.95 | CC0.GND@2 6.63,42.02 | 6.63,42.02 4.45,42.02 X5.GND@3 | MOTION.2 J1.1-8 | 4.45,36.95 4.29,36.95 X5.GND@4
  Bottom 0.508: BH1750.2 41.78,8.37 41.78,8.15 42.96,6.97 43.18,6.97 I2C-2.2 44.32,5.83 44.32,5.16 46.45,3.04 46.86,3.04 JP3.2 | C1.2 31.75,4.01 31.83,4.01 32.89,2.95 32.89,1.1 32.67,0.88 30.83,0.88 30.35,1.35 30.35,2.02 I2C-4.2 | 14.21,31.67 14.21,31.01 RFM69W.GNDB 11.26,31.01 10.8,31.47 5.95,31.47 4.45,29.96 | 14.21,31.67 14.21,34.85 RFM69W.GNDA 8.71,34.85 8.35,34.48 6.76,34.48 U1.GND_1 4.59,34.48 4.59,34.9 4.45,35.04 | 14.21,31.67 18.7,31.67 | 18.7,31.67 18.7,31.01 20.32,29.38 20.32,25.83 C10.1 | 18.7,31.67 19.51,32.48 19.59,32.48 U1.GND_2 23.35,32.48 23.72,32.12 24.52,32.12 25.24,32.85 v25.24,33.06 25.24,44.33 23.65,45.93 v23.48,45.93 23.35,46.06 23.35,46.48 U1.GND_3 | 10.65,12.32 9.39,13.59 9.21,13.59 R6.2 | M1.J7.9 10.65,12.32 | 10.65,12.32 12.68,14.34 12.68,17.26 RS485.5 | J1.2-8 J1.2-6 | J1.2-8 50,33.14 51.99,35.13 51.99,35.68 R2.1 | 3.54,36.95 4.45,36.95 4.45,35.04 | X5.GND@4 3.54,36.95 | X5.GND@3 3.54,40.52 3.54,36.95 | X2.GND@1 4.45,35.04 | 39.94,41.39 41.34,39.99 42.39,39.99 43.94,38.44 43.94,37.29 44.38,36.86 45.97,36.86 46.31,36.52 46.31,35.68 46.9,35.68 | 46.9,35.68 46.9,35.13 J1.2-8 | C2.2 46.9,35.68 | 39.94,41.39 40.51,41.39 40.51,41.61 41.43,42.53 43.68,42.53 45.19,44.04 45.19,45.23 C3.- | STEPDWN.2 39.94,41.39 | 42.19,20.44 41.27,21.36 41.27,23.1 40.64,23.74 I2C-3.3 | 42.19,20.44 42.32,20.31 43.02,20.31 43.94,19.39 43.94,19.16 MOTION.2 | 42.19,20.44 41.4,19.64 41.4,12.81 40.64,12.05 I2C-1.2 | 4.45,29.96 4.45,28.69 M1.J6.2 | 4.45,29.96 X2.GND@3 1.27,29.2 RS485-.4
  other vias: 5.71,2.66 6.99,2.66 37.47,2.02 39.37,2.02 52.07,2.02 60.96,8.37 62.87,10.28 59.69,12.81 55.24,10.91 61.59,30.59 62.23,33.14 39.37,45.84 36.83,45.84 57.78,46.47 31.75,29.32 19.68,34.41 1.27,13.45
  pour Top: 63.5,0.75 63.5,47.11 1.27,47.11 1.27,0.75
  pour Bottom: 63.5,0.75 63.5,47.11 1.27,47.11 1.27,0.75
IN
  Top 0.508: SV1.1 3.17,6.97 3.4,6.97 4.32,7.89 4.32,8.6 6,10.28 9.24,10.28 10.2,11.24 10.2,11.92 13.58,15.3 33.38,15.3 35.98,17.89 J1.1-7
  Bottom 0.508: 52.52,29.25 57.04,29.25 60.81,33.02 60.81,35.7 60.81,35.77 60.79,35.78 60.79,41.18 61.09,41.48 RAW1.1 62.05,42.66 62.12,42.59 F1.P$2 | JP1.2 48.39,4.09 47.8,4.67 47.8,14.52 48.64,15.36 49.16,15.36 51.44,17.63 J1.1-7 50.35,18.97 50.35,25.7 J1.2-3 52.52,27.87 52.52,29.25 | 52.52,29.25 52.52,30.78 J1.2-7
IRQ  (via drill 0.3 pad 0.61)
  Top 0.305: v19.4,44.35 24.04,44.35 24.39,44 CC0.GDO0 26.88,44 26.88,43.96 v27.9,42.94
  Bottom 0.305: 20.22,19.8 20.79,19.8 21.64,20.66 22.02,20.66 24.74,23.38 24.74,25.11 24.5,25.36 24.08,25.36 23.09,26.35 23.09,27.8 27.19,31.91 27.19,42.23 v27.9,42.94 30.72,42.94 31.01,43.23 RFM69W.DIO0 | M1.J7.8 18.51,16.09 20.08,16.09 20.68,16.69 20.68,18.07 20.22,18.53 | U1.DIO0 8.25,42.48 8.38,42.35 17.4,42.35 v19.4,44.35 | 20.22,18.53 20.14,18.53 RS485.3 | 20.22,18.53 20.22,19.8 | RS485.2 20.22,19.8
MISO  (via drill 0.3 pad 0.61)
  Top 0.305: IC3.2 15.88,43.25 18.58,40.54 v18.58,40.01 18.63,40.06 24.33,40.06 24.39,40 CC0.MISO 26.88,38.76 26.88,37.47 26.09,36.69 24.55,36.69 23.21,35.35 23.21,30.95 26.67,27.49 M1.J6.10
  Bottom 0.305: M1.J6.10 26.67,22.23 25.4,20.96 25.4,11.32 23.5,9.41 SV1.18 | RFM69W.MISO 14.11,39.01 15.11,40.01 v18.58,40.01 18.58,40.09 19.96,41.47 22.95,41.47 23.25,41.77 23.25,44.48 U1.MISO
MOSI  (via drill 0.3 pad 0.61)
  Top 0.305: v19.51,42 20.51,41 26.4,41 27.31,40.09 27.31,36.43 26.88,36 CC0.MOSI 23.64,34.01 23.64,31.6 28.46,26.79 M1.J6.11 | IC3.5 13.34,40.8 12.85,40.8 v12.08,40.03
  Bottom 0.305: M1.J6.11 27.83,25.4 27.83,21.95 27.66,21.78 27.66,14.13 27.71,14.09 27.71,11.11 26.57,9.97 26.16,9.97 24.77,8.58 24.77,8.14 23.5,6.87 SV1.17 | 19.36,42.15 v19.51,42 | 19.36,42.15 19.33,42.12 18.72,42.12 17.6,41.01 12.89,41.01 12.81,41.01 | 12.81,41.01 12.08,40.27 v12.08,40.03 | RFM69W.MOSI 12.81,41.01 | 19.36,42.15 19.69,42.48 U1.MOSI
RAW
  Bottom 0.508: RAW.1 4.45,26.15 M1.J6.1
RESET
  Bottom 0.305: SV1.7 10.79,6.87 9.75,7.91 9.75,10.68 M1.J7.10
RO  (via drill 0.3 pad 0.61)
  Top 0.305: v13.54,25.31 13.97,24.88 13.97,24.05 17.31,20.71 v17.34,20.71
  Bottom 0.305: v13.54,25.31 12.92,25.93 12.92,27.97 10.49,30.4 8.26,30.4 SJ3.2 | v17.34,20.71 17.7,21.07 RS485.1
RX
  Bottom 0.305: SJ3.1 9.78,28.24 9.92,28.1 9.92,26.29 6.51,22.88 6.04,22.88 5.1,21.94 5.1,20.2 6.3,19.01 6.76,19.01 7.73,18.03 7.73,12.93 M1.J7.11 6.35,11.32 8.26,9.41 SV1.6
SCK  (via drill 0.3 pad 0.61)
  Top 0.305: v14.35,37.89 14.51,38.05 14.61,38.05 IC3.6 | 24.39,38 23.25,39.14 v23.25,39.47 | M1.J6.9 24.13,29.37 22.78,30.72 22.78,36.39 24.39,38 | CC0.SCLK 24.39,38
  Bottom 0.305: M1.J6.9 25.96,24.95 25.96,22.88 23.06,19.98 23.06,9.7 22.45,9.09 22.45,5.4 23.07,4.78 23.94,4.78 24.99,5.83 SV1.19 | RFM69W.SCK 14.11,37.01 14.11,37.64 v14.35,37.89 17.29,37.89 19.69,40.28 19.69,40.48 U1.SCK 23.25,40.48 v23.25,39.47
TX  (via drill 0.3 pad 0.61)
  Top 0.305: M1.J7.12 3.81,15.71 6.47,18.37 8.29,18.37 v12.34,22.42
  Bottom 0.305: v12.34,22.42 13.82,23.9 13.82,24.74 15,25.92 15,27.59 14.35,28.24 SJ4.1 | SV1.5 8.26,6.87 7.21,7.91 7.21,8.34 4.01,11.54 M1.J7.12
UREG  (via drill 0.3 pad 0.61)
  Top 0.508: v19.9,31.03 14.06,31.03 10.29,27.26 10.29,26.58 8.88,25.16 v7.42,25.16 | v28.19,44.93 28.19,45.04 28.17,45.06 IC2.3 | STEPDWN.3 40.77,41.39 40.77,41.61 38.69,43.69 v34.47,43.69
  Bottom 0.508: 28.19,44.2 v28.19,44.93 | v34.47,43.69 33.96,44.2 28.19,44.2 | 28.19,44.2 26.59,42.6 26.59,33.3 24.32,31.03 v19.9,31.03 | v19.9,31.03 | RAW.2 6.93,24.12 6.93,24.67 v7.42,25.16 | 56.76,39.36 57.95,40.56 F1.P$1 59.35,42.59 59.42,42.66 RAW1.2 | 49.7,35.68 50.84,36.81 52.92,36.81 54.1,37.99 54.1,39.14 54.33,39.36 56.76,39.36 | 56.76,39.36 56.76,38.85 60.17,35.43 60.17,33.29 57.17,30.28 R1.1 | 49.7,35.68 49.11,35.68 49.11,36.3 48.46,36.96 47.26,36.96 46.23,37.99 46.23,39.14 45.12,40.25 43.97,40.25 43.05,41.17 43.05,41.39 STEPDWN.3 | C2.1 49.7,35.68
VCC  (via drill 0.3 pad 0.61)
  Top 0.508: v21.87,25.53 21.24,25.53 20.18,26.58 20.18,27.26 19.52,27.92 12.56,27.92 M1.J6.4 11.43,22.91 7.94,19.42 4.57,19.42 2.41,17.26 RS485-.1 | I2C-1.1 v34.04,10.91 | 28.64,43.51 28.59,43.47 28.59,41.83 28.19,41.43 28.19,38.98 v29.66,37.52 29.73,37.52 C6.2 | 28.64,43.51 27.04,45.11 27.04,46.51 26.37,47.18 13.5,47.18 12.56,46.23 12.56,45.71 10.84,43.99 v8.45,43.99 8.33,43.99 7.49,44.82 JP14.2 | 28.64,43.51 30.19,45.06 30.45,45.06 IC2.2 | MOTION.1 52,21.7 X1.1 X4.1 | SV1.3 6.86,5.83 6.86,5.61 8.45,4.01 26.3,4.01 27.94,2.37 27.94,1.67 28.73,0.88 29.69,0.88 30.61,1.8 30.61,2.02 I2C-4.1 | CC0.VCC 26.98,32 27.06,32.08 v28.84,32.08 | STEPDWN.4 43.31,41.39 43.31,41.17 42.38,40.24 37.98,40.24 STEPDWN.1
  Bottom 0.508: v21.87,25.53 22.57,25.53 23.81,24.29 C10.2 | 11.19,22.28 11.46,22.01 11.6,22.01 11.74,21.87 | 11.74,21.87 | 11.74,21.87 12.54,21.07 12.68,21.07 RS485.8 | M1.J6.4 11.43,23.35 11.19,23.11 11.19,22.28 | 11.19,22.28 | 11.19,22.28 11.11,22.2 R5.1 | 39.5,8.88 38.61,9.77 38.1,9.77 I2C-1.1 | 44.45,9.51 40.13,9.51 39.5,8.88 | 39.5,8.88 39.5,8.62 39.24,8.37 BH1750.1 | v34.04,10.91 32.3,9.17 31.75,9.17 C1.1 31.75,6.81 30.68,6.81 30.02,6.15 30.02,4.23 31.09,3.16 31.75,3.16 I2C-4.1 | v29.66,37.52 29.66,32.26 | 36.83,40.82 35.63,42.02 31.13,42.02 29.66,40.55 v29.66,37.52 | v29.66,37.52 | 29.66,32.26 30.91,31.01 RFM69W.VCC | v28.84,32.08 29.02,32.26 29.66,32.26 | 36.83,40.82 36.83,40.25 37.05,40.25 38.86,38.44 38.86,37.74 39.78,36.82 40.48,36.82 41.15,36.15 41.15,27.83 42.96,26.02 43.18,26.02 I2C-3.2 44.32,24.88 44.9,24.31 45.72,24.31 | STEPDWN.1 36.83,40.82 | U1.3.3V 4.59,40.48 4.59,43.24 4.81,43.47 8.1,43.47 8.45,43.82 v8.45,43.99 | 44.45,9.51 44.45,11.65 46.23,13.43 46.23,19.64 45.31,20.56 45.09,20.56 MOTION.1 45.09,22.07 45.09,22.43 45.09,23.1 45.72,23.74 45.72,24.31 | 44.45,9.51 44.45,8.02 45.5,6.97 45.72,6.97 I2C-2.1 | I2C-3.1 45.72,24.31 | 4.13,17.26 4.13,16.76 5.22,16.76 6.03,15.95 6.03,15.9 R8.2 6.03,14.13 6.03,13.54 4.2,13.54 2.67,12.02 2.67,10.02 3.17,9.51 SV1.2 3.17,7.23 3.4,7.23 4.57,6.05 4.57,5.83 SV1.3 | 4.13,17.26 R3.1 R7.1 | RS485-.1 4.13,17.26 | C3.+ 50.19,45.23 46.35,41.39 45.59,41.39 STEPDWN.4
VCC1
  Top 0.508: 15.88,37.94 15.88,37.17 15.56,36.86 R9.2 | 15.88,37.94 16.4,37.94 17.14,38.68 IC3.8 | 15.88,37.94 IC3.7 15.88,40.91 14.61,42.18 14.61,43.14 | JP14.1 6.48,44.82 8.15,43.14 14.61,43.14 | 14.61,43.14 IC3.3

### Text on the board
tPlace: Inclusion | by Ranseyer | by Ranseyer
tOrigins: Gehäuse 1: Box2252 / Geh2: 59x65 / Gehäuse 3: 67x98
tNames: IN | easySensor / (Standard-RJ45 V0.1) | EEPROM | EEPROM | ATSHA204A / (MySensors / optional) | StepDown | AMS1117 | MISO | Antenna | SCK | C6 | AT25DF512C | MOSI | 22p | R1 | R2 | 1M | 470K | GND | VCC | CC1101 / for / HM | + | GND | - | B | A | IN | IN A B GND | + | + | - | - | + | - | SCL | SDA | SCL | SDA | + | I2C | LAN
bNames: C3 10uF | MOSI | MISO | Fuse1 | SCK | GND | C2 | 0,1uF | Antenna | SW | HW | SW | Serial> | VCC | R5/6 | 22p | 10K | 330R | 10K | 150R | 330R | Max487 | 10K | easySensor / (Standard-RJ45 V0.1) | LAN5 | LAN4 | C1 10uF | LAN6 | LAN3
Milling: Please include the cutouts...